# Altium schematic sheet Neon-Demon-Earing-revB.SchDoc
size A4; SheetNumber: 1; SheetTotal: 1
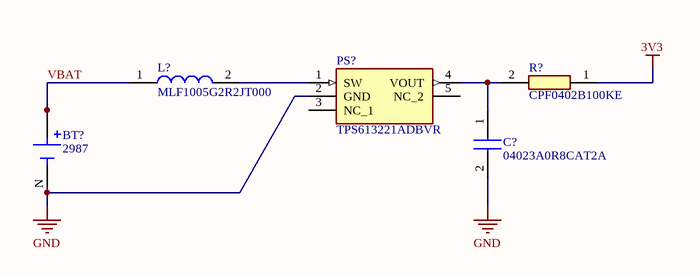
[diagram p0: Neon-Demon-Earing-revB.SchDoc]

## Parts
BT?  2987  [BAT_2987]
C?  04023A0R8CAT2A  [CAPC1005X56N]
L?  MLF1005G2R2JT000  [INDC1005X55N]
PS?  TPS613221ADBVR  [SOT95P280X145-5N]
R?  CPF0402B100KE  [RESC1005X35N]

## Nets
3V3: R?.1
GND: BT?.N(NEG) C?.2 PS?.2(GND)
VBAT: BT?.P1(POS) BT?.P2(POS) L?.1
NetC?_1: C?.1 PS?.4(VOUT) R?.2
NetL?_2: L?.2 PS?.1(SW)

Not connected (* = marked no-connect by the designer): PS? 3(NC_1) 5(NC_2)

## Library data of the parts
C? = 04023A0R8CAT2A: Capacitor; Manufacturer_Name: AVX; Datasheet Link: http://www.mouser.com/catalog/supplier/library/pdf/AVXSurfaceMountCeramic.pdf; Height: 0.56mm; Manufacturer_Part_Number: 04023A0R8CAT2A; Mouser Part Number: 581-04023A0R8CAT2A; Mouser Price/Stock: https://www.mouser.co.uk/ProductDetail/AVX/04023A0R8CAT2A?qs=ZwvTZoB9SO%252BVBOZ%252BNMbjzw%3D%3D
L? = MLF1005G2R2JT000: Inductor; Manufacturer_Name: TDK-Lambda; Datasheet Link: https://product.tdk.com/system/files/dam/doc/product/inductor/inductor/smd/catalog/inductor_commercial_standard_mlf1005_en.pdf; Height: 0.55mm; Manufacturer_Part_Number: MLF1005G2R2JT000; Mouser Part Number: 810-MLF1005G2R2JT000; Mouser Price/Stock: https://www.mouser.co.uk/ProductDetail/TDK/MLF1005G2R2JT000?qs=%2FPzWLGNeQ%252BhXmsvIBrs2gg%3D%3D
PS? = TPS613221ADBVR: Power Supply; Manufacturer_Name: Texas Instruments; Datasheet Link: http://www.ti.com/lit/gpn/tps61322; Height: 1.45mm; Manufacturer_Part_Number: TPS613221ADBVR; Mouser Part Number: 595-TPS613221ADBVR; Mouser Price/Stock: https://www.mouser.co.uk/ProductDetail/Texas-Instruments/TPS613221ADBVR?qs=W0yvOO0ixfEzYGaKZaJgrw%3D%3D; Arrow Part Number: TPS613221ADBVR; Arrow Price/Stock: https://www.arrow.com/en/products/tps613221adbvr/texas-instruments?region=nac
R? = CPF0402B100KE: Resistor; Manufacturer_Name: TE Connectivity; Datasheet Link: http://www.farnell.com/datasheets/1786775.pdf; Height: 0.35mm; Manufacturer_Part_Number: CPF0402B100KE; Mouser Part Number: 279-CPF0402B100KE; Mouser Price/Stock: https://www.mouser.co.uk/ProductDetail/TE-Connectivity-Holsworthy/CPF0402B100KE?qs=CXI0wBT1M2h4W2Gm72yIGA%3D%3D; Arrow Part Number: CPF0402B100KE; Arrow Price/Stock: https://www.arrow.com/en/products/cpf0402b100ke/te-connectivity?region=nac
BT? = 2987: Package: None; Price: None; Value: *; MP: 2987; Availability: Unavailable